# EAGLE design Thing_Plus_ESP32_C6 (EAGLE 9.6.2)
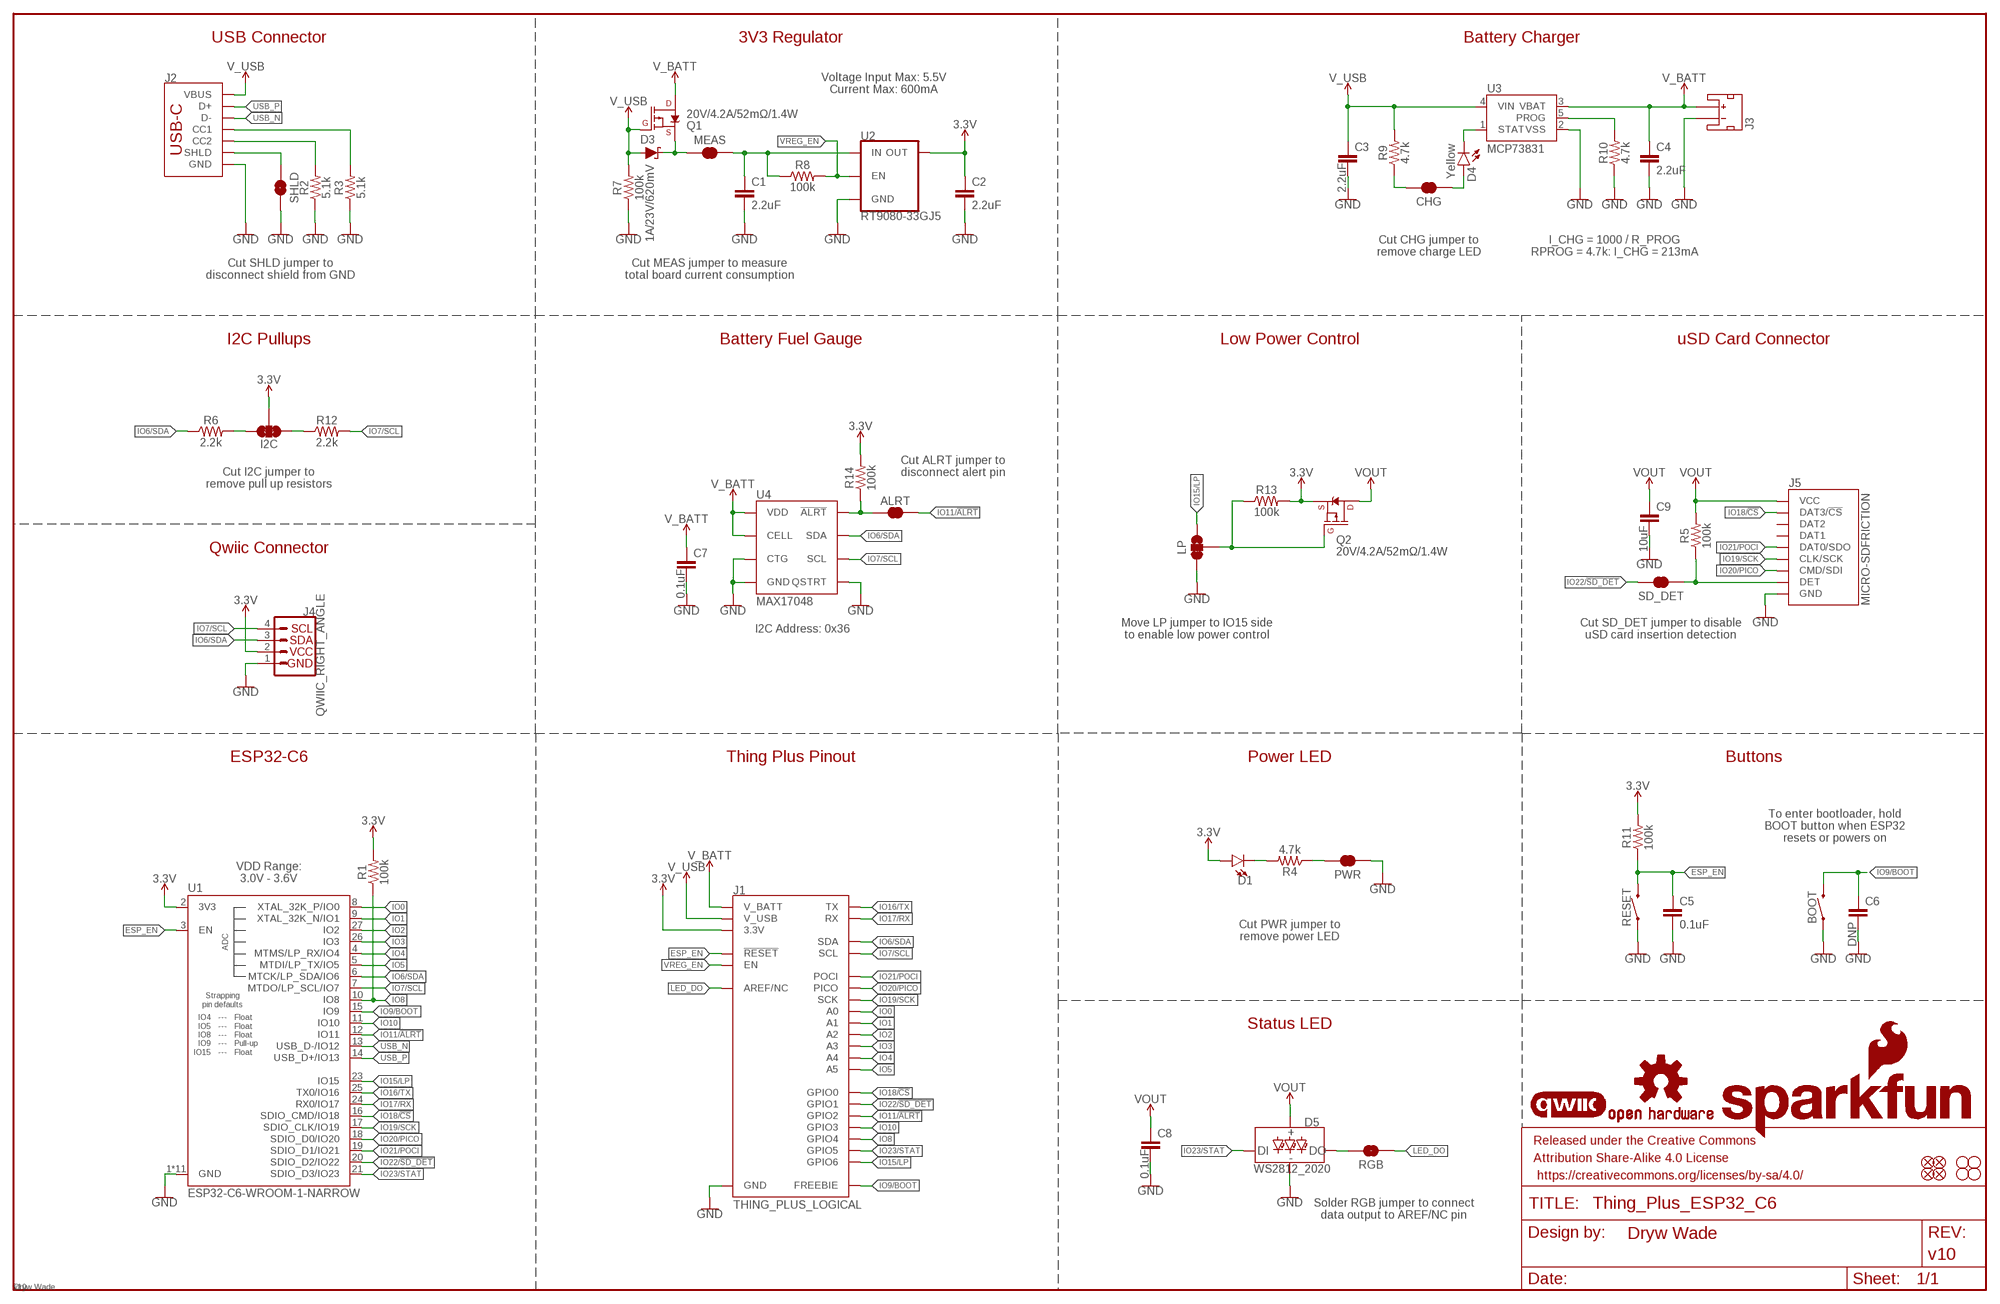
[diagram p0: schematic, sheet 1]

## Parts
ALRT  JUMPER-SMT_2_NC_TRACE_SILK  [SMT-JUMPER_2_NC_TRACE_SILK]
BOOT  MOMENTARY-SWITCH-SPST-SMD-4.6X2.8MM  [TACTILE_SWITCH_SMD_4.6X2.8MM]
C1  2.2uF  2.2UF-0603-10V-20%  [0603]
C2  2.2uF  2.2UF-0603-10V-20%  [0603]
C3  2.2uF  2.2UF-0603-10V-20%  [0603]
C4  2.2uF  2.2UF-0603-10V-20%  [0603]
C5  0.1uF  0.1UF-0603-25V-(+80/-20%)  [0603]
C6  DNP  0.1UF-0603-25V-(+80/-20%)  [0603]
C7  0.1uF  0.1UF-0603-25V-(+80/-20%)  [0603]
C8  0.1uF  0.1UF-0603-25V-(+80/-20%)  [0603]
C9  10uF  10UF-0603-6.3V-20%  [0603]
CHG  JUMPER-SMT_2_NC_TRACE_SILK  [SMT-JUMPER_2_NC_TRACE_SILK]
D1  LED-RED_0603-KB  [LED-0603]
D3  1A/23V/620mV  DIODE-SCHOTTKY-BAT20J  [SOD-323]
D4  Yellow  LED-YELLOW0603  [LED-0603]
D5  WS2812_2020  [WS2812-2020]
FD1  FIDUCIALUFIDUCIAL  [FIDUCIAL-MICRO]
FD2  FIDUCIALUFIDUCIAL  [FIDUCIAL-MICRO]
FD3  FIDUCIALUFIDUCIAL  [FIDUCIAL-MICRO]
FD4  FIDUCIALUFIDUCIAL  [FIDUCIAL-MICRO]
FRAME1  FRAME-LEDGER  [CREATIVE_COMMONS]
H1  STAND-OFF  [STAND-OFF]
H2  STAND-OFF  [STAND-OFF]
H3  STAND-OFF  [STAND-OFF]
H4  STAND-OFF  [STAND-OFF]
I2C  JUMPER-SMT_3_2-NC_TRACE_SILK  [SMT-JUMPER_3_2-NC_TRACE_SILK]
J1  THING_PLUS_LOGICAL  [THING_PLUS]
J2  USB_C_4-LAYER_PADS  [USB-C-16P_4LAYER-PADS]
J3  JST_2MM_MALE  [JST-2-SMD]
J4  QWIIC_RIGHT_ANGLE  QWIIC_CONNECTORJS-1MM  [JST04_1MM_RA]
J5  MICRO-SDFRICTION  [MICROSD_TINY]
LOGO1  SFE_LOGO_NAME_FLAME.1_INCH  [SFE_LOGO_NAME_FLAME_.1]
LOGO2  QWIIC_LOGO_4MM  [QWIIC_4MM]
LOGO3  OSHW-LOGOM  [OSHW-LOGO-M]
LP  JUMPER-SMT_3_1-NC_TRACE_SILK  [SMT-JUMPER_3_1-NC_TRACE_SILK]
MEAS  JUMPER-COMBO_2_NC_TRACE  [COMBO-JUMPER_2_NC_TRACE]
PWR  JUMPER-SMT_2_NC_TRACE_SILK  [SMT-JUMPER_2_NC_TRACE_SILK]
Q1  20V/4.2A/52mΩ/1.4W  MOSFET_PCH-DMG2305UX-7  [SOT23-3]
Q2  20V/4.2A/52mΩ/1.4W  MOSFET_PCH-DMG2305UX-7  [SOT23-3]
R1  100k  100KOHM-0603-1/10W-1%  [0603]
R2  5.1k  5.1KOHM5.1KOHM-0603-1/10W-1%  [0603]
R3  5.1k  5.1KOHM5.1KOHM-0603-1/10W-1%  [0603]
R4  4.7k  4.7KOHM-0603-1/10W-1%  [0603]
R5  100k  100KOHM-0603-1/10W-1%  [0603]
R6  2.2k  2.2KOHM-0603-1/10W-1%  [0603]
R7  100k  100KOHM-0603-1/10W-1%  [0603]
R8  100k  100KOHM-0603-1/10W-1%  [0603]
R9  4.7k  4.7KOHM-0603-1/10W-1%  [0603]
R10  4.7k  4.7KOHM-0603-1/10W-1%  [0603]
R11  100k  100KOHM-0603-1/10W-1%  [0603]
R12  2.2k  2.2KOHM-0603-1/10W-1%  [0603]
R13  100k  100KOHM-0603-1/10W-1%  [0603]
R14  100k  100KOHM-0603-1/10W-1%  [0603]
RESET  MOMENTARY-SWITCH-SPST-SMD-4.6X2.8MM  [TACTILE_SWITCH_SMD_4.6X2.8MM]
RGB  JUMPER-SMT_2_NO_SILK  [SMT-JUMPER_2_NO_SILK]
SD_DET  JUMPER-SMT_2_NC_TRACE_SILK  [SMT-JUMPER_2_NC_TRACE_SILK]
SHLD  JUMPER-SMT_2_NC_TRACE_SILK  [SMT-JUMPER_2_NC_TRACE_SILK]
U1  ESP32-C6-WROOM-1-NARROW  [ESP32-C6-WROOM-1-NARROW]
U2  RT9080-33GJ5  V_REG_RT9080  [SOT23-5]
U3  MCP73831  [SOT23-5]
U4  MAX17048  MAX17048DFN8  [DFN-8]

## Nets
3.3V: C2.1 D1.A I2C.2 J1.27(3.3V) J4.2 Q2.2(S) R1.2 R11.2 R13.2 R14.2 U1.2(3V3) U2.5(OUT)
ESP_EN: C5.1 J1.28(!RESET) R11.1 RESET.3 RESET.4 U1.3(EN)
GND: BOOT.1 BOOT.2 C1.2 C2.2 C3.2 C4.2 C5.2 C6.2 C7.2 C8.2 C9.2 D5.GND J1.25(GND) J2.GND J2.GND2(GND) J3.1(-) J4.1 J5.6(GND) J5.GND1(GND) J5.GND2(GND) J5.GND3(GND) J5.GND4(GND) J5.GND5(GND) J5.GND6(GND) LP.3 PWR.1 R2.1 R3.1 R7.1 R10.1 RESET.1 RESET.2 SHLD.2 U1.1(GND) U1.28(GND) U1.29(GND) U1.30(GND) U1.31(GND) U1.32(GND) U1.33(GND) U1.34(GND) U1.35(GND) U1.36(GND) U1.37(GND) U2.2(GND) U3.2(VSS) U4.1(CTG) U4.4(GND) U4.6(QSTRT) U4.9(GND)
IO0: J1.24(A0) U1.8(XTAL_32K_P/IO0)
IO1: J1.23(A1) U1.9(XTAL_32K_N/IO1)
IO2: J1.22(A2) U1.27(IO2)
IO3: J1.21(A3) U1.26(IO3)
IO4: J1.20(A4) U1.4(MTMS/LP_RX/IO4)
IO5: J1.19(A5) U1.5(MTDI/LP_TX/IO5)
IO6/SDA: J1.1(SDA) J4.3 R6.1 U1.6(MTCK/LP_SDA/IO6) U4.8(SDA)
IO7/SCL: J1.2(SCL) J4.4 R12.2 U1.7(MTDO/LP_SCL/IO7) U4.7(SCL)
IO8: J1.5(GPIO4) R1.1 U1.10(IO8)
IO9/BOOT: BOOT.3 BOOT.4 C6.1 J1.13(FREEBIE) U1.15(IO9)
IO10: J1.6(GPIO3) U1.11(IO10)
IO11/!ALRT!: ALRT.2 J1.7(GPIO2) U1.12(IO11)
IO15/LP: J1.3(GPIO6) LP.1 U1.23(IO15)
IO16/TX: J1.14(TX) U1.25(TX0/IO16)
IO17/RX: J1.15(RX) U1.24(RX0/IO17)
IO18/!CS!: J1.9(GPIO0) J5.2(DAT3/!CS!) U1.16(SDIO_CMD/IO18)
IO19/SCK: J1.18(SCK) J5.5(CLK/SCK) U1.17(SDIO_CLK/IO19)
IO20/PICO: J1.17(PICO) J5.3(CMD/SDI) U1.18(SDIO_D0/IO20)
IO21/POCI: J1.16(POCI) J5.7(DAT0/SDO) U1.19(SDIO_D1/IO21)
IO22/!SD_DET!: J1.8(GPIO1) SD_DET.2 U1.20(SDIO_D2/IO22)
IO23/STAT: D5.DI J1.4(GPIO5) U1.21(SDIO_D3/IO23)
LED_DO: J1.26(AREF/NC) RGB.1
N$1: D1.C R4.2
N$2: PWR.2 R4.1
N$3: J5.9(DET) R5.1 SD_DET.1
N$4: D3.C MEAS.1 MEAS.3 Q1.2(S)
N$5: I2C.3 R6.2
N$6: I2C.1 R12.1
N$7: J2.B5(CC2) R2.2
N$8: J2.A5(CC1) R3.2
N$9: C1.1 MEAS.2 MEAS.4 R8.1 U2.1(IN)
N$10: D4.C U3.1(STAT)
N$11: CHG.1 D4.A
N$12: CHG.2 R9.1
N$13: R10.2 U3.5(PROG)
N$14: D5.DO RGB.2
N$16: LP.2 Q2.1(G) R13.1
N$17: ALRT.1 R14.1 U4.5(!ALRT)
SHLD: J2.SHLD1(SHLD) J2.SHLD2(SHLD) J2.SHLD3(SHLD) J2.SHLD4(SHLD) SHLD.1
USB_N [USB]: J2.A7(D-) J2.B7(D-) U1.13(USB_D-/IO12)
USB_P [USB]: J2.A6(D+) J2.B6(D+) U1.14(USB_D+/IO13)
V_BATT: C4.1 C7.1 J1.12(V_BATT) J3.2(+) Q1.3(D) U3.3(VBAT) U4.2(CELL) U4.3(VDD)
V_USB: C3.1 D3.A J1.10(V_USB) J2.VBUS1(VBUS) J2.VBUS2(VBUS) Q1.1(G) R7.2 R9.2 U3.4(VIN)
VOUT: C8.1 C9.1 D5.VCC J5.4(VCC) Q2.3(D) R5.2
VREG_EN: J1.11(EN) R8.2 U2.3(EN)
Unconnected: J3.NC1(PAD1) J3.NC2(PAD2) J5.1(DAT2) J5.8(DAT1)

## Notes on the sheet
- USB Connector | 3V3 Regulator | Battery Charger
- Voltage Input Max: 5.5V
  Current Max: 600mA
- Cut CHG jumper to
  remove charge LED
- I_CHG = 1000 / R_PROG
  RPROG = 4.7k: I_CHG = 213mA
- Cut SHLD jumper to
  disconnect shield from GND
- Cut MEAS jumper to measure
  total board current consumption
- I2C Pullups | Battery Fuel Gauge | Low Power Control | uSD Card Connector
- Cut ALRT jumper to
  disconnect alert pin
- Cut I2C jumper to
  remove pull up resistors
- Qwiic Connector
- I2C Address: 0x36
- Move LP jumper to IO15 side
  to enable low power control
- Cut SD_DET jumper to disable
  uSD card insertion detection
- ESP32-C6 | Thing Plus Pinout | Power LED | Buttons
- To enter bootloader, hold
  BOOT button when ESP32
  resets or powers on
- VDD Range:
  3.0V - 3.6V
- Cut PWR jumper to
  remove power LED
- Status LED
- Solder RGB jumper to connect
  data output to AREF/NC pin

## Library data of the parts
ALRT CHG PWR SD_DET SHLD = SparkFun-Jumpers:JUMPER-SMT_2_NC_TRACE: Normally closed trace jumper This jumper has a trace between two pads so it's normally closed (NC). Use a razor knife to open the connection. For best results follow the IPC guidelines for cutting traces: Cutout at least 0.063 mm (0.005 in). Remove all loose material to clean up the cut area. Seal the cut with an approved epoxy. Reapply solder to reclose the connection.
BOOT RESET = SparkFun-Switches:MOMENTARY-SWITCH-SPST: Momentary Switch (Pushbutton) - SPST Normally-open (NO) SPST momentary switches (buttons, pushbuttons). Variants PTH-12MM - 12mm square, through-hole Momentary Pushbutton Switch - 12mm Square <https://www.sparkfun.com/products/9190> (COM-09190) PTH-6.0MM, PTH-6.0MM-KIT - 6.0mm square, through-hole Mini Pushbutton Switch <https://www.sparkfun.com/products/97> (COM-00097) KIT package intended for soldering kit's - only one side of pads' copper is exposed. PTH-RIGHT-ANGLE-KIT - Right-angle, through-hole Right Angle Tactile Button <https://www.sparkfun.com/products/10791> - Used on SparkFun BigTime Watch Kit <https://www.sparkfun.com/products/11734> SMD-12MM - 12mm square, surface-mount Tactile Button - SMD (12mm) <https://www.sparkfun.com/products/12993> (COM-12993) Used on SparkFun PicoBoard <https://www.sparkfun.com/products/11888> SMD-4.5MM - 4.5mm Square Trackball Switch Used on SparkFun Blackberry Trackballer Breakout <https://www.sparkfun.com/products/13169> SMD-4.6MMX2.8MM - 4.60mm x 2.80mm, surface mount Used on SparkFun Pro Micro - RP2040 <https://www.sparkfun.com/products/17717> SMD-5.2MM, SMD-5.2-REDUNDANT - 5.2mm square, surface-mount Mini Pushbutton Switch - SMD <https://www.sparkfun.com/products/8720> (COM-08720) Used on Arduino Pro Mini <https://www.sparkfun.com/products/11114> REDUNDANT package connects both switch circuits together SMD-6.0X3.5MM - 6.0 x 3.5mm, surface mount Momentary Reset Switch SMD <https://www.sparkfun.com/products/8229> (COM-08229) SMD-6.2MM-TALL - 6.2mm square, surface mount Tactile Button - SMD (6mm) <https://www.sparkfun.com/products/12992> Used on SparkFun Digital Sandbox <https://www.sparkfun.com/products/12651> SMD-RIGHT-ANGLE - Right-angle, surface mount Used on SparkFun Block for Intel® Edison - Arduino <https://www.sparkfun.com/products/13036>; PROD_ID: SWCH-15606
C1-C4 = SparkFun-Capacitors:2.2UF: 2.2µF ceramic capacitors A capacitor is a passive two-terminal electrical component used to store electrical energy temporarily in an electric field.; PROD_ID: CAP-07888
C5 C7 C8 = SparkFun-Capacitors:0.1UF: 0.1µF ceramic capacitors A capacitor is a passive two-terminal electrical component used to store electrical energy temporarily in an electric field.; PROD_ID: CAP-00810
C6 = SparkFun-Capacitors:0.1UF: 0.1µF ceramic capacitors A capacitor is a passive two-terminal electrical component used to store electrical energy temporarily in an electric field.; VALUE: 0.1uF
C9 = SparkFun-Capacitors:10UF: 10.0µF ceramic capacitors A capacitor is a passive two-terminal electrical component used to store electrical energy temporarily in an electric field.; PROD_ID: CAP-11015
D1 = SparkFun-LED:LED-RED: Red SMD LED Used in manufacturing of most products at SparkFun Packages: 0603 - KB - KingBright (DIO-17976) SMD 0603 package [Datasheet] <https://www.kingbrightusa.com/images/catalog/SPEC/APT1608SURCK.pdf> 0603 - (DIO-00819, has gone EOL) SMD 0603 package 0603 SMART - SMD 0603 SMART package ( more efficient and expensive)[Product Link] <http://www.osram-os.com/Graphics/XPic2/00077099_0.pdf> 1206 - SMD1206 package [Product Link] <https://www.sparkfun.com/datasheets/DevTools/LilyPad/Q150OVS4.pdff> SparkFun Products: Pro Mini 328 -5V <https://www.sparkfun.com/products/821> RedBoard <https://www.sparkfun.com/products/12757> IOIO-OTG <https://www.sparkfun.com/products/13613>; PROD_ID: DIO-17976
D3 = SparkFun-DiscreteSemi:DIODE-SCHOTTKY: Schottky diode A Schottky diode is a semiconductor diode which has a low forward voltage drop and a very fast switching action.; PROD_ID: DIO-11623
D4 = SparkFun-LED:LED-YELLOW: Yellow SMD LED Used in manufacturing several products at SparkFun. Packages: 0603 - SMD 0603 package[Product Link] <http://www.kingbrightusa.com/product.asp?catalog_name=LED&product_id=APT1608SYCK> 0603 -SMART - SMART SMD 0603 package (more efficient/more expensive) [Product Link] <http://www.osram-os.com/osram_os/en/products/product-catalog/led-light-emitting-diodes/smartled-0603/ly-l29k/index.jsp> LilyPad - SMD1206 package[Product Datasheet] <https://www.sparkfun.com/datasheets/DevTools/LilyPad/Q150YUS4.pdf> SparkFun Products: Blynk Board <https://www.sparkfun.com/products/13794> IOIO-OTG <https://www.sparkfun.com/products/13613> XBee Explorer Serial <https://www.sparkfun.com/products/13225>; PROD_ID: DIO-09003
D5 = SparkFun-LED:WS2812: Addressable RGB LED - 1 Wire Common names: WS2812, SK6812, Neopixel, APA-106, etc. SMD LED with built-in controller IC. Color: Red/Green/Blue SparkFun Products: LED-SMD RGB (WS2812) <https://www.sparkfun.com/products/11821> LED - RGB Addressable, PTH, 5mm Diffused (5 Pack) <https://www.sparkfun.com/products/12986> LED - RGB Addressable, PTH, 5mm Clear (5 Pack) <https://www.sparkfun.com/products/12999> Blynk Board - ESP8266 <https://www.sparkfun.com/products/13794> Datasheet referenced for footprint: WS2812B-PTH <https://cdn.sparkfun.com/datasheets/Components/LED/COM-12877.pdf>; PROD_ID: DIO-15591
FD1-FD4 = SparkFun-Aesthetics:FIDUCIAL: Fiducial Alignment Points Point-of-reference for pick-and-place machines and other optical instruments.
FRAME1 = SparkFun-Aesthetics:FRAME-LEDGER: Schematic Frame - Ledger Standard 11x14 US Ledger frame; DESIGNER: Dryw Wade; REV: v10
H1-H4 = SparkFun-Hardware:STAND-OFF: Stand Off Drill holes for mechanically mounting via screws, standoffs, etc. Note: Use the keepout ring to avoid running the screw head into surrounding components. Variant Overviews STAND-OFF - Mechanical footprint for a #4 phillips button head screw. STAND-OFF-TIGHT - Mechanical footprint for a #4 phillips button head screw, Example SparkFun Products Screw - Phillips Head (1/4", 4-40, 10 pack) <https://www.sparkfun.com/products/10453> (PRT-10453) Screw - Phillips Head (1/2", 4-40, 10 pack) <https://www.sparkfun.com/products/10452> (PRT-10452) Screw - Phillips Head (3/4", 4-40, 10 pack) <https://www.sparkfun.com/products/10451> (PRT-10451) Screw - Phillips Head (1", 4-40, 10 pack) <https://www.sparkfun.com/products/10450> (PRT-10450)
I2C = SparkFun-Jumpers:JUMPER-SMT_3_2-NC_TRACE: Normally closed trace jumper (2 of 2 connections) This jumper has a trace between all three pads so they are normally closed (NC). Use a razor knife to open the connection(s). For best results follow the IPC guidelines for cutting traces: Cutout at least 0.063 mm (0.005 in). Remove all loose material to clean up the cut area. Seal the cut with an approved epoxy. Reapply solder to reclose the connection(s).
J1 = SparkFun-Boards:THING_PLUS_LOGICAL
J2 = SparkFun-Connectors:USB_C: USB Type C 16Pin Connector Super Speed pins not available on the 16-pin purely SMD connector so this part is best for USB 2.0 implementations. D1 and D2 are tied together enabling D+/- no matter which way the cable is plugged into the connector. The two channel configuration pins (CC1/2) are exposed. These are normally connected to ground via 5.1k resistors but can be reconfigured for high current/high power applications. **4-LAYER BOARD WARNING!!** If designing 4-layer board, make sure to select the variant _4-LAYER-ISOLATED. The linked footprint (USB-C-16-4LAYER-ISOLATED) includes some very necessary cutout polygons in the inner layers (2 and 15). This prevents the PTH mounting shield legs on the USB connector from electrically connecting any other polygons on the inner layers (usually VCC and GND).; PROD_ID: CONN-14122
J3 = SparkFun-Connectors:JST_2MM_MALE: JST 2MM MALE RA CONNECTOR Two pin, compact surface mount connector. Commonly used as a battery input connection point. We really like the solid locking feeling and high current rating on these small connectors. We use these all the time as battery connectors. Mates to single-cell LiPo batteries. Here is the connector we sell at SparkFun: JST Right Angle Connector - White <https://www.sparkfun.com/products/8612> (PRT-08612) Datasheet <http://www.sparkfun.com/datasheets/Prototyping/Connectors/JST-Horizontal.pdf> It was used on these SparkFun products: SparkFun MOSFET Power Controller <https://www.sparkfun.com/products/11214> (PRT-11214) SparkFun Battery Babysitter - LiPo Battery Manager <https://www.sparkfun.com/products/13777> (PRT-13777) And many, many others that required a lipo battery connection.; PROD_ID: CONN-11443; SF_ID: PRT-08612
J4 = SparkFun-Connectors:QWIIC_CONNECTOR: SparkFun I2C Standard Qwiic Connector An SMD 1mm pitch JST connector makes it easy and quick (get it? Qwiic?) to connect I2C devices to each other. The Qwiic system <http://www.sparkfun.com/qwiic> enables fast and solderless connection between popular platforms and various sensors and actuators. We carry 200mm <https://www.sparkfun.com/products/14204>, 100mm <https://www.sparkfun.com/products/14205>, 50mm <https://www.sparkfun.com/products/14206>, and breadboard friendly <https://www.sparkfun.com/products/14207> Qwiic cables. We also offer 10 pcs strips <https://www.sparkfun.com/products/14323> the SMD connectors.; PROD_ID: CONN-13694
J5 = SparkFun-Connectors:MICRO-SD: microSD Socket for Transflash Various sockets for µSD. tDoc lines correctly indicate media card edge positions when inserting (unlocked, locked, depressed). NOTE: CD1 and CD2 are connected internally, and the default detect state of the socket is detect pin to ground. SparkFun Products: WAV Trigger <https://www.sparkfun.com/products/13660> CAN-Bus Shield <https://www.sparkfun.com/products/13262> SparkFun Level Shifing microSD Breakout <https://www.sparkfun.com/products/13743>; PROD_ID: CONN-13500
LOGO1 = SparkFun-Aesthetics:SFE_LOGO_NAME_FLAME: SparkFun Font Logo w/ Flame This is the SparkFun full logo. The logo on the schematic will always be the same size; the package variant is the height of the flame part of the logo. Default layer for the logo on the board is tSilk.
LOGO2 = SparkFun-Aesthetics:QWIIC_LOGO: Qwiic Logos for placement on schematic and PCB. The 5.5mm silk logo is best for placing next to Qwiic connector.
LOGO3 = SparkFun-Aesthetics:OSHW-LOGO: Open-Source Hardware (OSHW) Logo This logo indicates the piece of hardware it is found on incorporates a OSHW license and/or adheres to the definition of open source hardware found here: http://freedomdefined.org/OSHW
LP = SparkFun-Jumpers:JUMPER-SMT_3_1-NC_TRACE: Normally closed trace jumper (1 of 2 connections) This jumper has a trace between two pads so it's normally closed (NC). The other connection is normally open (NO). Use a razor knife to open the connection. For best results follow the IPC guidelines for cutting traces: Cutout at least 0.063 mm (0.005 in). Remove all loose material to clean up the cut area. Seal the cut with an approved epoxy. Reapply solder to reclose the connection, or to close the NO connection.
MEAS = SparkFun-Jumpers:JUMPER-COMBO_2_NC_TRACE
Q1 Q2 = SparkFun-DiscreteSemi:MOSFET_PCH: P-channel MOSFETs Voltage controlled devices that allow control of high current outputs. SparkFun Products: SparkFun ESP32 Thing <https://www.sparkfun.com/products/13907> SparkFun ESP8266 Thing <https://www.sparkfun.com/products/13231> SparkFun Pi Servo HAT V2 <https://www.sparkfun.com/products/15316> DMG2305UX-7 (20V/4.2A/SOT23-3); PROD_ID: TRANS-14388
R1 R5 R7 R8 R11 R13 R14 = SparkFun-Resistors:100KOHM: 100kΩ resistor A resistor is a passive two-terminal electrical component that implements electrical resistance as a circuit element. Resistors act to reduce current flow, and, at the same time, act to lower voltage levels within circuits. - Wikipedia; PROD_ID: RES-07828
R2 R3 = SparkFun-Resistors:5.1KOHM; PROD_ID: RES-12083
R4 R9 R10 = SparkFun-Resistors:4.7KOHM: 4.7kΩ resistor A resistor is a passive two-terminal electrical component that implements electrical resistance as a circuit element. Resistors act to reduce current flow, and, at the same time, act to lower voltage levels within circuits. - Wikipedia; PROD_ID: RES-07857
R6 R12 = SparkFun-Resistors:2.2KOHM: 2.2kΩ resistor A resistor is a passive two-terminal electrical component that implements electrical resistance as a circuit element. Resistors act to reduce current flow, and, at the same time, act to lower voltage levels within circuits. - Wikipedia; PROD_ID: RES-08272
RGB = SparkFun-Jumpers:JUMPER-SMT_2_NO: Normally open jumper This jumper has two pads in close proximity to each other. Apply solder to close the connection. Round pads are easier to solder for beginners, but are a lot larger. SparkFun Product that uses the round pads: SparkFun EL Sequencer <https://www.sparkfun.com/products/12781>
U1 = ESP32-C6-WROOM-1:ESP32-C6-WROOM-1; PROD_ID: IC-19032
U2 = SparkFun-IC-Power:V_REG_RT9080; PROD_ID: VREG-19034
U3 = SparkFun-IC-Power:MCP73831: MCP73831T Li-Ion, Li-Pol Controller Miniature single cell, fully integrated Li-Ion, Li-polymer charge management controller Datasheet <http://ww1.microchip.com/downloads/en/DeviceDoc/20001984g.pdf> SparkFun Products: SparkFun ESP32 Thing <https://www.sparkfun.com/products/13907> SparkFun 9DoF Razor IMU M0 <https://www.sparkfun.com/products/14001>; PROD_ID: IC-09995
U4 = SparkFun-IC-Power:MAX17048: Micropower 1-Cell Li+ ModelGauge SparkFun Products Qduino Mini <https://www.sparkfun.com/products/13614> (DEV-13614); PROD_ID: IC-12551

## Net classes
1 USB: width 0.247 mm, clearance 0.178 mm to class 0, clearance 0.178 mm

## Board
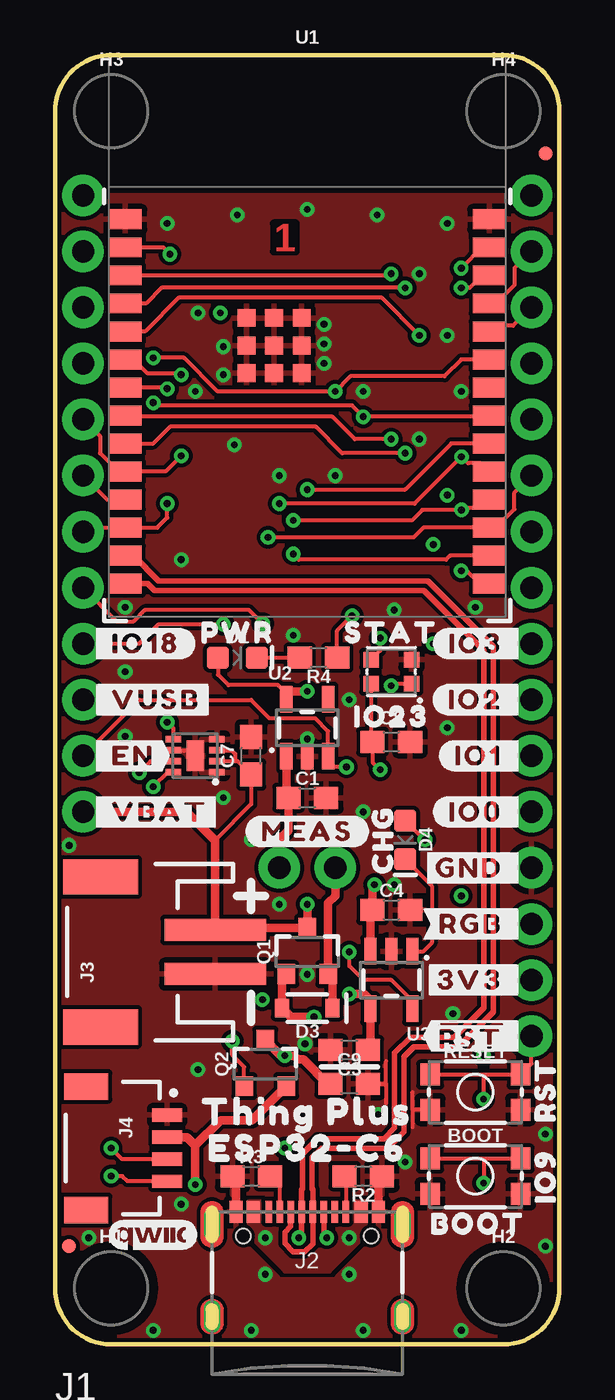
[diagram p1: board, top side]
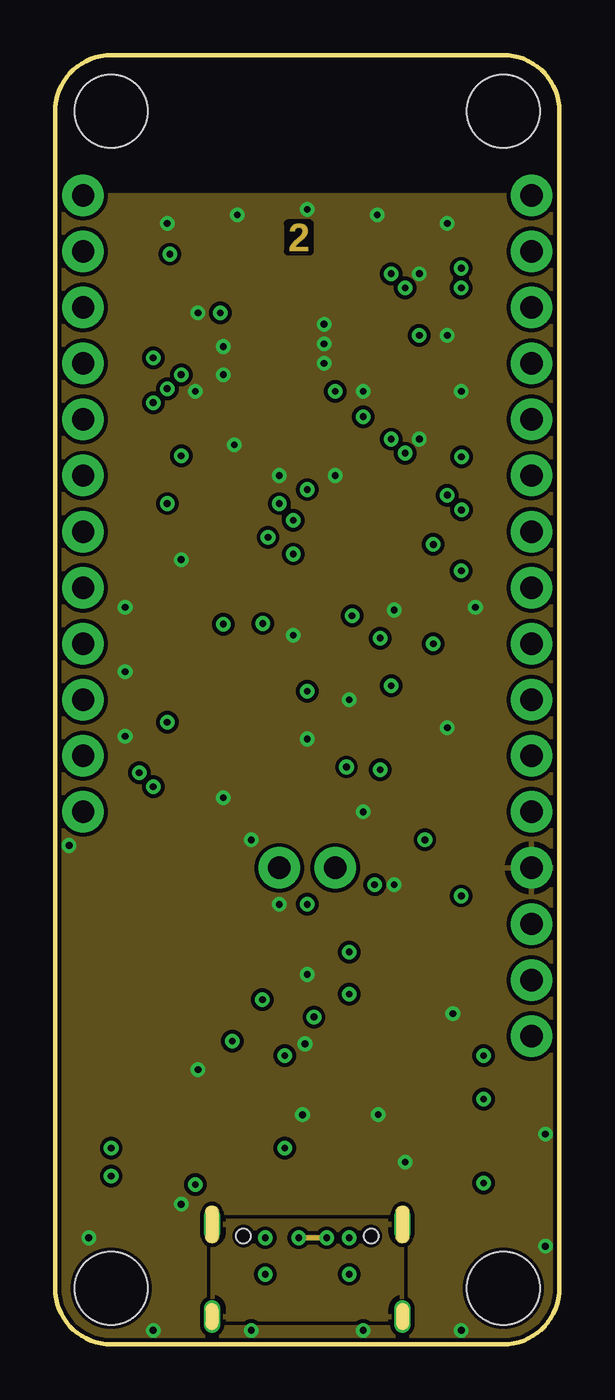
[diagram p2: board, inner layer Route2]
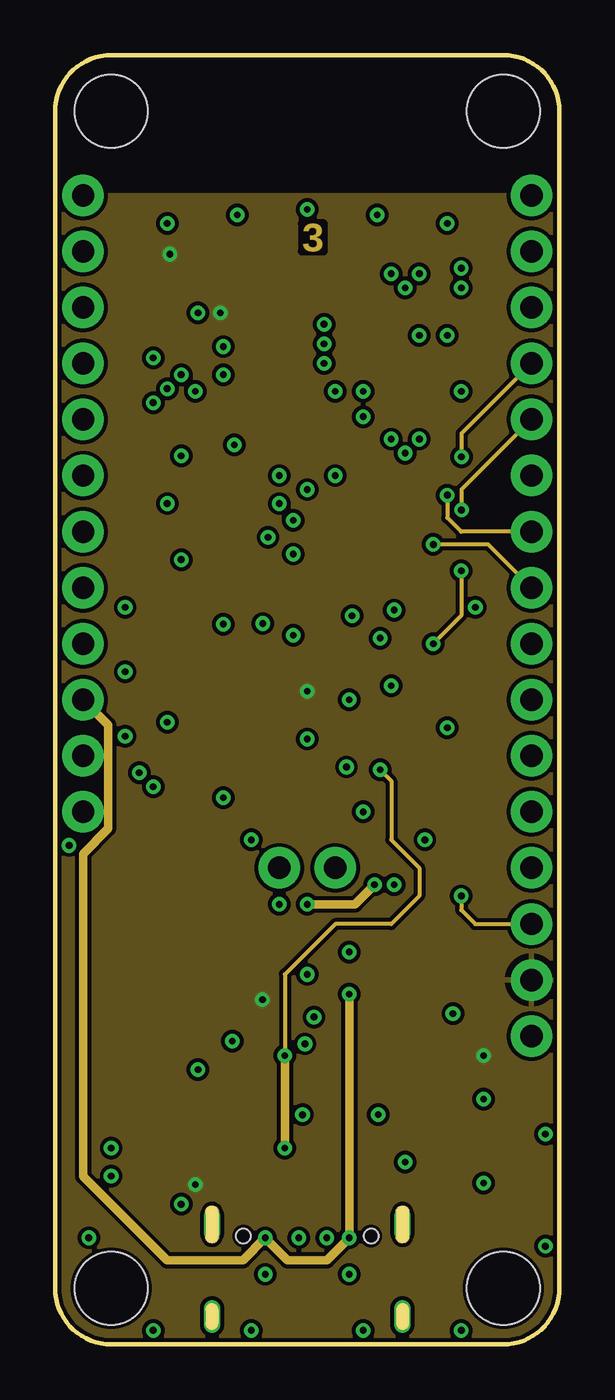
[diagram p3: board, inner layer Route15]
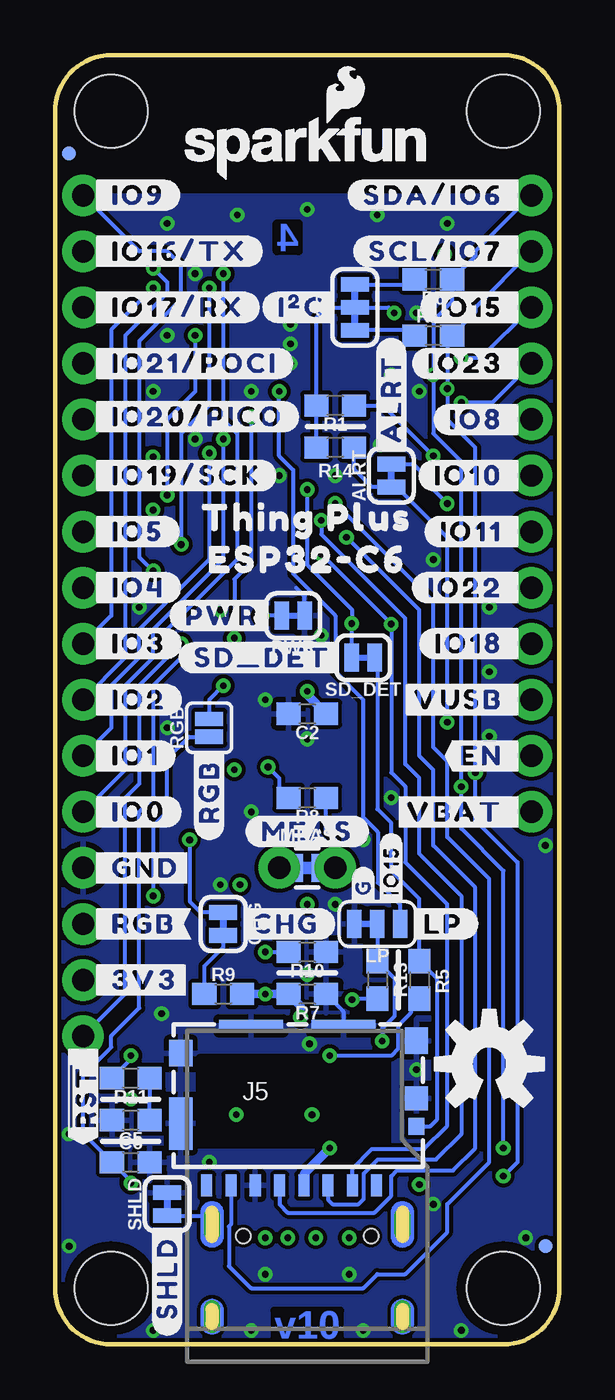
[diagram p4: board, bottom side, seen from below]

Size 22.86 x 58.42 mm. Coordinates in mm from the lower left corner, seen from the top.
Outline: 0,2.54 0,55.88 arc-90 2.54,58.42 20.32,58.42 arc-90 22.86,55.88 22.86,2.54 arc-90 20.32,0 2.54,0 arc-90 0,2.54
Copper layers (1+2*15+16): Top 0.035559375mm / dielectric 0.47751875mm / Route2 0.035559375mm / dielectric 0.47751875mm / Route15 0.035559375mm / dielectric 0.47751875mm / Bottom 0.035559375mm
Design rules "SparkFun-4-Layer-General-JLCPCB": minimum track width 7mil, minimum drill 12mil, track to track 7mil, track to pad 7mil, pad to pad 7mil, via to via 7mil, smd to smd 7mil, copper to edge 7mil, drill to drill 7mil, minimum pad ring 7mil, minimum via ring 7mil, stop-mask expansion 3mil, vias tented up to drill 25mil, thermal gap 10mil

### Footprints (pad centres in the part's own frame; a part is rotated, then mirrored left to right if it is on the bottom)
SMT-JUMPER_2_NC_TRACE_SILK = smd 0.66 x 1.27: 1 -0.521,0; 2 0.521,0
TACTILE_SWITCH_SMD_4.6X2.8MM = smd 0.9 x 1: 1 -2.05,-0.8; 2 2.05,-0.8; 3 2.05,0.8; 4 -2.05,0.8
0603 = smd 1.1 x 1: 1 -0.85,0; 2 0.85,0
LED-0603 = smd 1 x 1: A -0.877,0; C 0.877,0
SOD-323 = smd 0.63 x 0.83: A 1.15,0; C -1.15,0
WS2812-2020 = smd 0.7 x 0.7: DI -0.915,0.55; DO 0.915,-0.55; GND 0.915,0.55; VCC -0.915,-0.55
FIDUCIAL-MICRO = smd 0.635 x 0.635: 1 0,0
STAND-OFF = hole 3.302: 0,0
SMT-JUMPER_3_2-NC_TRACE_SILK = smd 0.66 x 1.27: 1 -1.041,0; 2 0,0; 3 1.041,0
THING_PLUS = drill 1.016 pad 1.88: 1 1.27,52.07; 2 1.27,49.53; 3 1.27,46.99; 4 1.27,44.45; 5 1.27,41.91; 6 1.27,39.37; 7 1.27,36.83; 8 1.27,34.29; 9 1.27,31.75; 10 1.27,29.21; 11 1.27,26.67; 12 1.27,24.13; 13 21.59,52.07; 14 21.59,49.53; 15 21.59,46.99; 16 21.59,44.45; 17 21.59,41.91; 18 21.59,39.37; 19 21.59,36.83; 20 21.59,34.29; 21 21.59,31.75; 22 21.59,29.21; 23 21.59,26.67; 24 21.59,24.13; 25 21.59,21.59; 26 21.59,19.05; 27 21.59,16.51; 28 21.59,13.97
USB-C-16P_4LAYER-PADS = smd 0.3 x 1: A5 -1.25,-0.34; A6 -0.25,-0.34; A7 0.25,-0.34; A8 1.25,-0.34; B5 1.75,-0.34; B6 0.75,-0.34; B7 -0.75,-0.34; B8 -1.75,-0.34 | smd 0.6 x 1: GND -3.225,-0.34; GND2 3.225,-0.34; VBUS1 -2.45,-0.34; VBUS2 2.45,-0.34 | drill 0.4 pad 0.6 long: SHLD1 -4.318,-0.915; SHLD2 4.318,-0.915; SHLD3 -4.318,-5.095; SHLD4 4.318,-5.095 | hole 0.65: -2.89,-1.445; 2.89,-1.445
JST-2-SMD = smd 1 x 4.6: 1 -1,-3.7; 2 1,-3.7 | smd 1.6 x 3.4: NC1 -3.4,1.5; NC2 3.4,1.5
JST04_1MM_RA = smd 0.6 x 1.35: 1 -1.5,0; 2 -0.5,0; 3 0.5,0; 4 1.5,0 | smd 1.2 x 2: NC1 2.8,-3.675; NC2 -2.8,-3.675
MICROSD_TINY = smd 0.5 x 1: 1 3.55,-3.85; 2 2.45,-3.85; 3 1.35,-3.85; 4 0.25,-3.85; 5 -0.85,-3.85; 6 -1.95,-3.85; 7 -3.05,-3.85; 8 -4.15,-3.85 | smd 0.72 x 0.78: 9 5.35,-1.17 | smd 1.05 x 1.08: GND1 5.35,0.1 | smd 1.05 x 1.2: GND2 5.35,2.71; GND3 -5.325,2.14 | smd 1.05 x 2.39: GND4 -5.325,-1.045 | smd 2.91 x 0.55: GND5 -2.145,3.385; GND6 2.045,3.385
SMT-JUMPER_3_1-NC_TRACE_SILK = smd 0.66 x 1.27: 1 -1.041,0; 2 0,0; 3 1.041,0
COMBO-JUMPER_2_NC_TRACE = smd 0.635 x 1.27: 1 -0.508,0; 2 0.508,0 | drill 1.016 pad 1.88: 3 -1.27,0; 4 1.27,0
SOT23-3 = smd 0.8 x 0.9: 1 -0.95,-1; 2 0.95,-1; 3 0,1.1
SMT-JUMPER_2_NO_SILK = smd 0.635 x 1.27: 1 -0.406,0; 2 0.406,0
ESP32-C6-WROOM-1-NARROW = smd 1.5 x 0.9: 1 -8.25,5.26; 2 -8.25,3.99; 3 -8.25,2.72; 4 -8.25,1.45; 5 -8.25,0.18; 6 -8.25,-1.09; 7 -8.25,-2.36; 8 -8.25,-3.63; 9 -8.25,-4.9; 10 -8.25,-6.17; 11 -8.25,-7.44; 12 -8.25,-8.71; 13 -8.25,-9.98; 14 -8.25,-11.25; 15 8.25,-11.25; 16 8.25,-9.98; 17 8.25,-8.71; 18 8.25,-7.44; 19 8.25,-6.17; 20 8.25,-4.9; 21 8.25,-3.63; 22 8.25,-2.36; 23 8.25,-1.09; 24 8.25,0.18; 25 8.25,1.45; 26 8.25,2.72; 27 8.25,3.99; 28 8.25,5.26 | smd 0.8 x 0.8: 29 -2.755,0.79; 30 -2.755,-0.46; 31 -2.755,-1.71; 32 -1.505,-1.71; 33 -0.255,-1.71; 34 -0.255,-0.46; 35 -0.255,0.79; 36 -1.505,0.79; 37 -1.505,-0.46
SOT23-5 = smd 0.55 x 1.2: 1 -0.95,-1.3; 2 0,-1.3; 3 0.95,-1.3; 4 0.95,1.3; 5 -0.95,1.3
DFN-8 = smd 0.3 x 0.7: 1 -0.75,-0.99; 2 -0.25,-0.99; 3 0.25,-0.99; 4 0.75,-0.99; 5 0.75,0.99; 6 0.25,0.99; 7 -0.25,0.99; 8 -0.75,0.99 | smd 1.38 x 0.8: 9 0,0

### Placement (x,y rotation side)
ALRT  7.62,39.37 90 bottom
BOOT  19.05,7.62 0 top
C1  11.43,24.77 0 top
C2  11.43,28.57 180 bottom
C3  13.34,13.34 180 top
C4  15.24,19.68 0 top
C5  19.43,10.16 180 bottom
C6  19.43,8.26 0 bottom
C7  8.89,26.67 90 top
C8  15.24,27.3 0 top
C9  13.34,11.81 0 top
CHG  15.24,19.05 270 bottom
D1  8.26,31.11 0 top
D3  11.43,15.24 180 top
D4  15.88,22.86 270 top
D5  15.24,30.48 0 top
FD1  22.23,53.98 0 top
FD2  22.23,53.98 0 bottom
FD3  0.64,4.45 0 top
FD4  0.64,4.45 0 bottom
FRAME1  -2.54,-34.29 0 top  (outside the outline)
H1  2.54,2.54 0 top
H2  20.32,2.54 0 top
H3  2.54,55.88 0 top
H4  20.32,55.88 0 top
I2C  9.27,46.99 90 bottom
J1  0,0 0 top
J2  11.43,6.35 0 top
J3  3.56,17.78 90 top
J4  5.08,8.89 270 top
J5  11.84,11.05 0 bottom
LOGO1  11.43,54.23 0 bottom
LOGO2  4.45,4.95 0 top
LOGO3  3.17,12.7 0 bottom
LP  8.26,19.05 180 bottom
MEAS  11.43,21.59 0 bottom
PWR  12.06,33.02 180 bottom
Q1  11.43,17.78 0 top
Q2  9.53,12.7 0 top
R1  10.16,42.55 180 bottom
R2  13.97,7.62 180 top
R3  8.89,7.62 0 top
R4  11.94,31.11 180 top
R5  6.35,16.51 270 bottom
R6  5.71,48.26 180 bottom
R7  11.43,15.88 180 bottom
R8  11.43,24.77 180 bottom
R9  15.24,15.88 0 bottom
R10  11.43,17.78 180 bottom
R11  19.43,12.06 180 bottom
R12  5.71,45.72 0 bottom
R13  8.26,16.51 270 bottom
R14  10.16,40.64 180 bottom
RESET  19.05,11.43 0 top
RGB  15.88,27.94 90 bottom
SD_DET  8.89,31.11 180 bottom
SHLD  17.78,6.35 90 bottom
U1  11.43,45.72 0 top
U2  11.43,27.94 0 top
U3  15.24,16.51 180 top
U4  6.35,26.67 90 top
U$1  [#SHLD#0]  17.78,5.59 90 bottom
U$2  [#I�C#0]  9.91,46.99 0 bottom
U$3  [#_IO18#0]  1.52,31.75 0 top
U$4  [#_VUSB#0]  1.52,29.21 0 top
U$5  [#_VBAT#0]  1.52,24.13 0 top
U$6  [#_EN#0]  1.52,26.67 0 top
U$7  [#IO3_#0]  21.34,31.75 0 top
U$8  [#IO2_#0]  21.34,29.21 0 top
U$9  [#IO1_#0]  21.34,26.67 0 top
U$10  [#IO0_#0]  21.34,24.13 0 top
U$11  [#GND_#0]  21.34,21.59 0 top
U$12  [#3V3_#0]  21.34,16.51 0 top
U$13  [##RST#_#0]  21.34,13.97 0 top
U$14  [#SDA#IO6_#0]  1.52,52.07 0 bottom
U$15  [#SCL#IO7_#0]  1.52,49.53 0 bottom
U$16  [#_IO21#POCI#0]  21.34,44.45 0 bottom
U$17  [#LP#0]  6.86,19.05 0 bottom
U$18  [#IO8_#0]  1.52,41.91 0 bottom
U$19  [#IO10_#0]  1.52,39.37 0 bottom
U$20  [#IO11_#0]  1.52,36.83 0 bottom
U$21  [#_IO19#SCK#0]  21.34,39.37 0 bottom
U$22  [#IO18_#0]  1.52,31.75 0 bottom
U$23  [#_IO9#0]  21.34,52.07 0 bottom
U$24  [#_IO16#TX#0]  21.34,49.53 0 bottom
U$25  [#_IO17#RX#0]  21.34,46.99 0 bottom
U$26  [#_IO20#PICO#0]  21.34,42.04 0 bottom
U$27  [#IO15#0]  7.62,19.81 90 bottom
U$28  [#ALRT#0]  7.62,40.13 90 bottom
U$29  [#_IO5#0]  21.34,36.83 0 bottom
U$30  [#_IO4#0]  21.34,34.29 0 bottom
U$31  [#_IO3#0]  21.34,31.75 0 bottom
U$32  [#_IO2#0]  21.34,29.21 0 bottom
U$33  [#_IO1#0]  21.34,26.67 0 bottom
U$34  [#_IO0#0]  21.34,24.13 0 bottom
U$35  [#_GND#0]  21.34,21.59 0 bottom
U$36  [#_3V3#0]  21.34,16.51 0 bottom
U$37  [##RST#_#0]  21.59,13.72 90 bottom
U$38  [#VUSB_#0]  1.52,29.21 0 bottom
U$39  [#VBAT_#0]  1.52,24.13 0 bottom
U$40  [#EN_#0]  1.52,26.67 0 bottom
U$41  [#SD_DET#0]  9.65,31.11 0 bottom
U$42  [BOOT0]  19.18,5.46 0 top
U$43  [RST0]  22.23,11.56 90 top
U$44  [IO90]  22.23,7.62 90 top
U$45  [THING_PLUS0]  11.43,10.54 0 top
U$46  [ESP32#C60]  11.43,8.89 0 top
U$47  [THING_PLUS0]  11.43,37.47 0 bottom
U$48  [ESP32#C60]  11.43,35.56 0 bottom
U$49  [#MEAS#0]  11.43,23.24 0 top
U$50  [#MEAS#0]  11.43,23.24 0 bottom
U$51  [#CHG#0]  14.61,19.05 0 bottom
U$52  [#PWR#0]  12.95,33.02 0 bottom
U$53  [PWR0]  8.26,32.26 0 top
U$54  [CHG0]  14.86,22.86 90 top
U$55  [STAT0]  15.24,32.26 0 top
U$56  [#RGB#0]  15.88,27.18 90 bottom
U$57  [ORDERING_INSTRUCTIONS]  34.29,50.8 0 top  (outside the outline)
U$58  [#RGB_#0]  21.34,19.05 0 top
U$59  [#_RGB#0]  21.34,19.05 0 bottom
U$62  [IO230]  15.24,28.45 0 top
U$63  [#G#0]  8.89,19.81 90 bottom
U$64  [#IO23_#0]  1.52,44.45 0 bottom
U$65  [#IO15_#0]  1.52,46.99 0 bottom
U$66  [#IO22_#0]  1.52,34.29 0 bottom

### Tracks (layer width: path | path; a pad name or v marks a point on that pad's centre or on a via)
3.3V  (via drill 0.3)
  Top 0.178: U1.2 4.9,49.71 v5.21,49.4 | D1.A 7.38,30.35 7.86,29.88 10.1,29.88 10.48,29.49 U2.5
  Top 0.381: v6.35,7.24 6.35,9.02 | J4.2 5.98,9.39 6.35,9.02 | v11.43,29.59 10.58,29.59 10.48,29.49 | 6.35,9.02 7.49,10.16 8.94,10.16 Q2.2
  Bottom 0.178: R11.2 19.43,12.91 v19.43,13.08 | v7.49,46.74 7.75,46.99 I2C.2 10.54,46.99 11.01,46.52 R1.2 R14.2 | R13.2 9.36,15.66 v9.4,15.62
  Bottom 0.381: C2.1 11.43,29.43 v11.43,29.59
  pour Route15 (isolate 0.178): 0,0 22.86,0 22.86,52.07 0,52.07
ESP_EN  (via drill 0.3)
  Top 0.178: U1.3 15.17,48.44 v15.24,48.51 | J1.28 21.59,12.72 RESET.3 19.43,12.23 | RESET.4 19.43,12.23 | v19.43,11.11 19.43,12.23
  Bottom 0.178: J1.28 19.68,15.88 19.68,24.77 19.05,25.4 19.05,29.84 17.78,31.11 17.78,32.38 14.61,35.56 14.61,41.27 15.24,41.91 v15.24,48.51 | C5.1 18.58,11.11 | R11.1 18.58,11.11 | 18.58,11.11 v19.43,11.11
GND  (via drill 0.3)
  Top 0.178: RESET.1 16.22,10.63 | 16.22,10.63 16.21,10.63 16.21,11.43 | 16.22,10.63 16.21,10.62 16.21,9.86 | C9.2 15,11.81 | 15,11.81 15,12.83 | 15,11.81 15,10.92 | U4.6 6.1,26.92 U4.9
  Top 0.381: J2.GND 8.21,7.46 R3.1 | J2.GND2 14.65,7.46 R2.1
  Bottom 0.178: R7.1 9.79,15.09 J5.GND6 | PWR.1 11.54,33.9 11.94,34.29
  other vias: 15.88,8.26 6.48,12.45 3.17,27.56 3.17,33.4 17.78,50.8 11.43,51.44 5.08,50.8 7.62,45.21 13.34,29.21 17.78,27.94 22.23,4.45 18.41,0.64 4.45,0.64 1.52,4.83 0.64,22.61 8.89,22.86 19.05,33.4 11.43,27.43 10.16,19.94 14.64,10.41 18.03,14.99 11.33,13.61 5.71,6.35 11.43,16.76 15.37,20.83 13.97,0.64 22.23,9.53 10.79,32.13 9.53,3.17 13.34,3.17 13.97,24.13 8.89,0.64 5.71,35.56 7.62,24.77 3.17,30.48 12.7,39.37 10.16,39.37 16.51,41.02 18.41,43.18 16.51,48.51 12.19,45.34 7.62,43.94 6.48,46.74 15.37,33.27 8.13,40.77 13.97,43.18 6.35,43.18 17.78,45.72 12.19,44.45 12.19,46.23 8.26,51.18 14.61,51.18 11.21,10.4
  pour Top (isolate 0.178, rank 2): 0,0 22.86,0 22.86,52.07 0,52.07
  pour Route2 (isolate 0.178, rank 2): 0,0 22.86,0 22.86,52.07 0,52.07
  pour Bottom (isolate 0.178): 0,0 22.86,0 22.86,52.07 0,52.07
IO0  (via drill 0.3)
  Top 0.178: v15.24,41.02 13.59,41.02 12.57,42.04 3.23,42.04 U1.8
  Bottom 0.178: J1.24 19.68,26.04 19.68,29.84 18.41,31.11 18.41,32.38 15.24,35.56 v15.24,41.02
IO1  (via drill 0.3)
  Top 0.178: U1.9 4.45,40.82 5.21,41.58 11.82,41.58 13.01,40.39 v15.88,40.39
  Bottom 0.178: v15.88,40.39 15.88,35.56 19.05,32.38 19.05,31.11 20.32,29.84 20.32,27.94 J1.23
IO2  (via drill 0.3)
  Top 0.178: U1.27 19.36,49.71 v18.41,48.77
  Bottom 0.178: v18.41,48.77 17.78,48.13 17.78,47.62 19.68,45.72 19.68,31.11 J1.22
IO3  (via drill 0.3)
  Top 0.178: U1.26 19.36,48.44 18.8,47.88 v18.41,47.88
  Bottom 0.178: v18.41,47.88 20.32,45.97 20.32,33.02 J1.21
IO4  (via drill 0.3)
  Top 0.178: U1.4 4.12,47.17 4.83,47.88 v15.88,47.88
  Route15 0.178: J1.20 19.63,36.25 v17.14,36.25
  Bottom 0.178: v15.88,47.88 15.88,42.55 17.14,41.27 v17.14,36.25
IO5  (via drill 0.3)
  Top 0.178: v16.51,45.72 14.81,47.42 5.59,47.42 4.07,45.9 U1.5
  Route15 0.178: J1.19 18.41,36.83 17.78,37.47 v17.78,38.48
  Bottom 0.178: v16.51,45.72 16.51,43.18 17.78,41.91 v17.78,38.48
IO6/SDA  (via drill 0.3)
  Top 0.178: v5.71,43.94 5.66,43.99 4.2,43.99 3.56,44.63 U1.6 | J4.3 3.04,8.39 v2.54,8.89 | U4.8 5.09,25.92 v4.45,25.27
  Bottom 0.178: v2.54,8.89 2.54,21.46 4.45,23.37 v4.45,25.27 4.45,40.01 5.71,41.27 v5.71,43.94 5.71,46.39 4.87,47.24 R6.1 3.81,49.31 3.81,49.53 J1.1
IO7/SCL  (via drill 0.3)
  Top 0.178: v5.08,43.31 5.03,43.36 U1.7 | J4.4 3.28,7.39 3.05,7.62 v2.54,7.62 | v3.81,25.91 4.32,26.42 U4.7
  Bottom 0.178: v2.54,7.62 1.91,8.26 1.91,21.84 3.81,23.75 v3.81,25.91 3.81,40.64 5.08,41.91 v5.08,43.31 5.08,45.51 R12.2 3.81,46.77 3.81,46.99 J1.2
IO8  (via drill 0.3)
  Top 0.178: v5.71,40.26 5.01,39.55 U1.10 2.87,39.55 2.03,40.39 2.03,41.15 J1.5
  Bottom 0.178: R1.1 8,42.55 v5.71,40.26
IO9/BOOT  (via drill 0.3)
  Top 0.178: U1.15 19.25,34.47 18.67,35.05 v18.41,35.05 | BOOT.4 19.43,8.42 | 19.43,8.42 BOOT.3 | 19.43,8.42 v19.43,7.3
  Route15 0.178: v18.41,35.05 18.41,33.02 v17.14,31.75
  Bottom 0.178: v18.41,35.05 19.05,35.69 19.05,45.47 17.14,47.37 17.14,48.9 17.78,49.53 19.05,49.53 J1.13 | v19.43,7.3 19.43,7.41 C6.1 21.59,9.56 21.59,12.19 20.32,13.46 20.32,13.97 19.05,15.24 19.05,24.13 18.41,24.77 18.41,29.84 17.14,31.11 v17.14,31.75
IO10
  Top 0.178: U1.11 2.36,38.28 J1.6
IO11/!ALRT!  (via drill 0.3)
  Top 0.178: J1.7 1.45,37.01 U1.12 4.62,37.01 5.08,37.47 v5.08,38.1
  Bottom 0.178: ALRT.2 6.62,39.89 5.97,39.24 5.97,38.99 v5.08,38.1
IO15/LP  (via drill 0.3)
  Top 0.178: U1.23 18.41,44.63 17.65,43.87 13.39,43.87 v12.7,43.18 7.37,43.18 5.84,44.7 v4.45,44.7
  Bottom 0.178: LP.1 7.21,19.91 8.23,20.93 8.23,23.22 8.89,23.88 8.89,29.21 10.16,30.48 10.16,33.02 12.06,34.92 12.06,39.62 12.7,40.26 v12.7,43.18 | v4.45,44.7 3.56,44.7 J1.3
IO16/TX
  Top 0.178: U1.25 19.99,47.17 20.83,48.01 20.83,48.77 J1.14
IO17/RX
  Top 0.178: U1.24 19.93,46.15 20.75,46.15 J1.15
IO18/!CS!  (via drill 0.3)
  Top 0.178: U1.16 17.9,35.74 17.72,35.56 11.05,35.56 v10.79,35.81 | v7.62,32.64 4.7,32.64 3.81,31.75 J1.9
  Bottom 0.178: J5.2 9.39,7.96 8.5,8.85 6.14,8.85 5.08,9.91 5.08,19.94 6.99,21.84 6.99,25.27 7.62,25.91 v7.62,32.64 v10.79,35.81
IO19/SCK  (via drill 0.3)
  Top 0.178: J1.18 20.83,38.61 20.83,37.85 19.99,37.01 U1.17 16.69,37.01 16.26,36.58 v9.65,36.58
  Bottom 0.178: J5.5 12.69,6.34 12.32,5.97 8.39,5.97 7.62,6.74 7.62,7.62 7.37,7.87 4.83,7.87 3.81,8.89 3.81,20.7 5.71,22.61 5.71,26.04 6.35,26.67 6.35,33.27 v9.65,36.58
IO20/PICO  (via drill 0.3)
  Top 0.178: U1.18 19.3,37.9 18.51,37.9 v18.42,37.81 16.64,37.81 16.17,37.34 v10.79,37.34
  Route15 0.178: J1.17 18.42,38.74 v18.42,37.81
  Bottom 0.178: v10.79,37.34 10.79,36.7 6.99,32.89 6.99,26.29 6.35,25.65 6.35,22.23 4.45,20.32 4.45,9.53 5.59,8.38 8.23,8.38 8.87,7.74 8.87,6.59 9.11,6.35 10.29,6.35 10.49,6.55 J5.3
IO21/POCI  (via drill 0.3)
  Top 0.178: v10.16,38.1 16.3,38.1 v18.42,40.22 18.71,39.93 19.3,39.93 U1.19
  Route15 0.178: J1.16 18.42,41.28 v18.42,40.22
  Bottom 0.178: v10.16,38.1 5.71,33.66 5.71,27.05 5.08,26.42 5.08,22.99 3.17,21.08 3.17,8.26 5.08,6.35 5.08,5.08 6.99,3.17 8.26,3.17 8.89,2.54 13.97,2.54 14.98,3.55 14.98,5.34 14.89,5.43 J5.7
IO22/!SD_DET!  (via drill 0.3)
  Top 0.178: U1.20 17.96,40.82 15.88,38.73 v11.43,38.73 | v9.41,32.66 8.8,33.27 4.06,33.27 3.56,32.77 2.79,32.77 J1.8
  Bottom 0.178: SD_DET.2 v9.41,32.66 9.41,33.3 11.43,35.32 v11.43,38.73
IO23/STAT  (via drill 0.3)
  Top 0.178: D5.DI 14.73,31.44 v14.73,32 | U1.21 19.63,42.04 v13.97,42.04 13.46,42.55 4.57,42.55 v4.45,42.67
  Bottom 0.178: v13.97,42.04 13.97,35.43 14.73,34.67 v14.73,32 | J1.4 3.05,42.67 v4.45,42.67
LED_DO  (via drill 0.3)
  Route15 0.178: v18.41,20.32 18.41,19.68 19.05,19.05 J1.26
  Bottom 0.178: v18.41,20.32 18.41,23.5 17.78,24.13 17.78,26.54 16.79,27.53 RGB.1
N$1
  Top 0.178: D1.C R4.2
N$2  (via drill 0.3)
  Top 0.178: v13.46,33.02 12.79,32.35 R4.1
  Bottom 0.178: PWR.2 v13.46,33.02
N$3
  Bottom 0.178: J5.9 5.85,9.88 5.56,10.17 5.56,16.57 R5.1 6.35,20.19 7.62,21.46 7.62,23.62 8.26,24.26 8.26,31 SD_DET.1
N$4
  Top 0.381: D3.C 12.58,16.58 Q1.2 12.38,20 12.7,20.32 MEAS.3
  Bottom 0.381: MEAS.3 MEAS.1
N$5
  Bottom 0.178: I2C.3 6.79,48.03 R6.2
N$6
  Bottom 0.178: R12.1 6.79,45.95 I2C.1
N$7
  Top 0.178: R2.2 13.18,7.56 J2.B5
N$8
  Top 0.178: R3.2 10.18,7.18 J2.A5
N$9
  Top 0.381: MEAS.4 10.16,22.86 10.58,23.28 C1.1 10.48,24.86 U2.1
  Bottom 0.178: MEAS.4 10.16,22.86 10.58,23.28 C1.1
  Bottom 0.381: MEAS.2 MEAS.4
N$10
  Top 0.178: U3.1 16.7,17.81 17.08,18.19 17.08,20.78 D4.C
N$11  (via drill 0.3)
  Top 0.178: v16.76,22.86 v16.75,22.86 D4.A
  Bottom 0.178: v16.76,22.86 16.76,20.08 16.26,19.57 CHG.1
N$12
  Bottom 0.178: CHG.2 15.24,18 16.09,17.14 R9.1
N$13  (via drill 0.3)
  Top 0.178: U3.5 16.19,15.56 15.24,16.51 13.97,16.51 13.34,17.14 v13.34,17.78
  Bottom 0.178: v13.34,17.78 R10.2
N$14  (via drill 0.3)
  Top 0.178: D5.DO 15.32,29.93 v15.24,29.84
  Bottom 0.178: v15.24,29.84 15.88,29.21 RGB.2
N$16  (via drill 0.3)
  Top 0.178: Q2.1 8.57,12.57 8.03,13.11 v8.03,13.75
  Bottom 0.178: LP.2 R13.1 7.49,16.59 7.49,14.86 8.03,14.32 v8.03,13.75
N$17  (via drill 0.3)
  Top 0.178: U4.5 5.36,27.91 v5.08,28.19
  Bottom 0.178: v5.08,28.19 5.08,36.56 7.37,38.85 ALRT.1 8.5,38.85 9.31,39.66 R14.1
SHLD
  Bottom 0.178: J2.SHLD2 16.13,5.82 17.77,5.82 SHLD.1
  pour Route2 (isolate 0.178): 7.11,1.14 15.75,1.14 15.75,5.59 7.11,5.59
USB_N
  Top 0.247: U1.13 3.55,35.74 4.7,34.59 16.9,34.59 19.86,31.63 19.86,15.06 18.27,13.48 16.28,13.48 15.82,13.02 15.82,9.63 15.08,8.89 12.06,8.89 11.64,8.47 11.64,7.04 11.68,7 J2.A7 11.68,5.09 11.68,4.56 11.31,4.19 10.79,4.19 10.41,4.57 10.41,4.83 10.42,4.83 10.42,5.09 10.68,5.35 J2.B7
USB_P  (via drill 0.3)
  Top 0.247: U1.14 4.2,34.47 4.5,34.16 16.72,34.16 19.43,31.45 19.43,15.24 18.1,13.91 16.1,13.91 15.39,13.2 15.39,9.8 14.9,9.31 11.89,9.31 11.22,8.64 11.22,7.04 11.18,7 J2.A6 11.18,4.96 v11.05,4.83 | J2.B6 12.18,4.96 v12.32,4.83
  Route2 0.247: v12.32,4.83 v11.05,4.83
V_BATT  (via drill 0.3)
  Top 0.178: 8.16,26.42 8.29,26.42 C7.1 8.89,24.48 7.26,22.84 | 8.16,26.42 U4.2 | U4.3 8.01,26.92 8.16,26.76 8.16,26.42
  Top 0.381: J1.12 5.97,24.13 7.26,22.84 J3.2 7.36,18.88 Q1.3 v11.43,19.94 | U3.3 14.29,19.59 C4.1 14.39,20.74 v14.48,20.83
  Route15 0.381: v11.43,19.94 13.59,19.94 v14.48,20.83
V_USB  (via drill 0.3)
  Top 0.381: C3.1 14.29,13.44 U3.4 14.29,15.59 14.01,15.88 v13.34,15.88 | Q1.1 10.28,16.58 D3.A 10.69,14.83 v11.73,14.83
  Route15 0.381: J1.10 2.41,28.07 2.41,23.37 1.27,22.23 1.27,7.62 5.08,3.81 8.51,3.81 v9.53,4.83 10.54,3.81 12.32,3.81 v13.34,4.83 v13.34,15.88
  Bottom 0.381: v13.34,15.88 R9.2 R7.2 11.73,15.33 v11.73,14.83
  pour Top (isolate 0.178, no thermals): 8.76,6.48 8.76,4.95 10.41,3.3 12.45,3.3 14.1,4.95 14.1,6.48
VOUT  (via drill 0.3)
  Top 0.178: v14.73,26.04 14.39,26.38 C8.1 14.32,27.37 D5.VCC
  Top 0.381: Q2.3 10.24,13.08 v10.41,13.08 10.83,13.08 11.01,12.9 11.27,12.9 12.36,11.81 C9.1
  Route15 0.178: v14.73,26.04 15.24,25.53 15.24,22.86 16.51,21.59 16.51,20.32 15.24,19.05 12.7,19.05 10.41,16.76 v10.41,13.08
  Route15 0.381: v10.41,13.08 v10.41,8.89
  Bottom 0.178: R5.2 6.73,15.28 6.73,15.03 7.32,14.43 7.32,13.38 7.62,13.08 v10.41,13.08
  Bottom 0.381: v10.41,8.89 11.59,7.72 J5.4
VREG_EN  (via drill 0.3)
  Top 0.178: J1.11 3.81,29.21 8.89,29.21 9.73,28.37 11.79,28.37 12.38,27.78 U2.3 12.38,26.36 12.57,26.16 v13.21,26.16
  Bottom 0.178: R8.2 12.7,25.18 12.7,25.65 v13.21,26.16

### Text on the board
Top: 1
Route2: 2
Route15: 3
Bottom: 4 | v10
Measures: Units: Inches
tDocu: 4-layer / JLC7628 Stackup / Material: TG135-140 / 1oz outer layers / 0.5oz inner layers / Board thickness: 1.6mm / Soldermask: Red / Silkscreen: White / Surface Finish: Lead-Free HASL | Dryw Wade